# Altium schematic sheet MCU.SchDoc
size A4
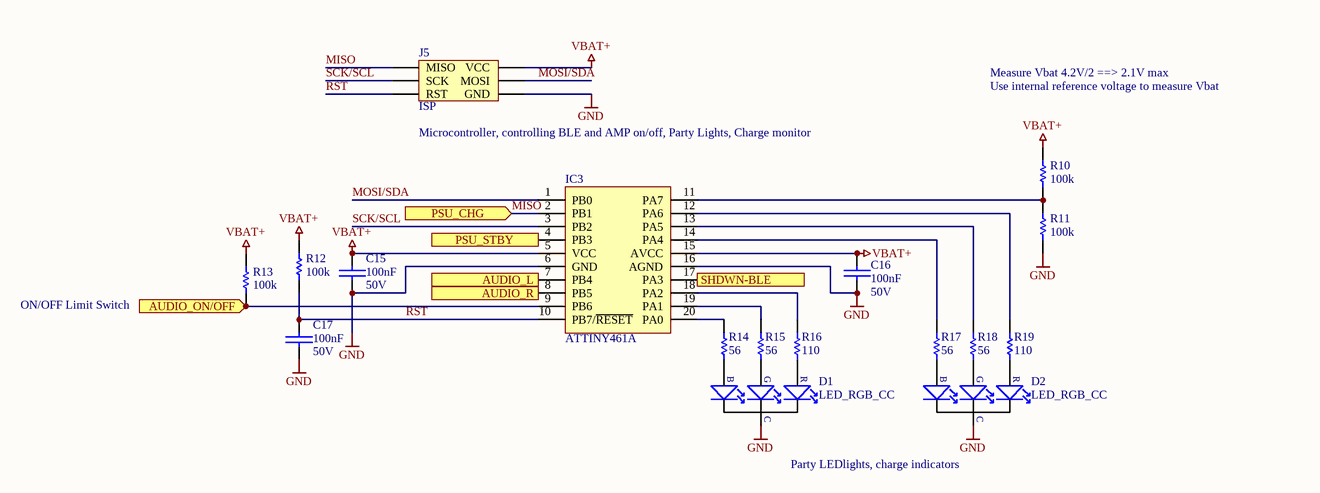
[diagram p0: MCU.SchDoc]

## Parts
C15  value 100nF  voltage: 50V  [TH5.08]  (hidden comment: cap_non_pol)
C16  value 100nF  voltage: 50V  [TH5.08]  (hidden comment: cap_non_pol)
C17  value 100nF  voltage: 50V  [TH5.08]  (hidden comment: cap_non_pol)
D1  LED_RGB_CC  [5MM-RGB-CC]
D2  LED_RGB_CC  [5MM-RGB-CC]
IC3  ATTINY461A  [PDIP-20]
J5  ISP  [ISP_COMPACT]
R10  value 100k  [TH6.3]  (hidden comment: resistor)
R11  value 100k  [TH6.3]  (hidden comment: resistor)
R12  value 100k  [TH6.3]  (hidden comment: resistor)
R13  value 100k  [TH6.3]  (hidden comment: resistor)
R14  value 56  [TH6.3]  (hidden comment: resistor)
R15  value 56  [TH6.3]  (hidden comment: resistor)
R16  value 110  [TH6.3]  (hidden comment: resistor)
R17  value 56  [TH6.3]  (hidden comment: resistor)
R18  value 56  [TH6.3]  (hidden comment: resistor)
R19  value 110  [TH6.3]  (hidden comment: resistor)

## Ports
AUDIO_L (in), AUDIO_ON/OFF (in), AUDIO_R (in), PSU_CHG (in), PSU_STBY (in), SHDWN-BLE (out)

## Nets
GND: C15.2 C16.2 C17.2 D1.C D2.C IC3.6(GND) IC3.16(AGND) J5.GND R11.1
VBAT+: C15.1 C16.1 IC3.5(VCC) IC3.15(AVCC) J5.VCC R10.2 R12.2 R13.2
AUDIO_L: IC3.7(PB4) ; port AUDIO_L
AUDIO_ON/OFF: IC3.9(PB6) R13.1 ; port AUDIO_ON/OFF
AUDIO_R: IC3.8(PB5) ; port AUDIO_R
MISO: IC3.2(PB1) J5.MISO ; port PSU_CHG
MOSI/SDA: IC3.1(PB0) J5.MOSI
PSU_STBY: IC3.4(PB3) ; port PSU_STBY
RST: C17.1 IC3.10(PB7/~{RESET}) J5.RST R12.1
SCK/SCL: IC3.3(PB2) J5.SCK
SHDWN-BLE: IC3.17(PA3) ; port SHDWN-BLE
NetD1_B: D1.B R14.2
NetD1_G: D1.G R15.2
NetD1_R: D1.R R16.2
NetD2_B: D2.B R17.2
NetD2_G: D2.G R18.2
NetD2_R: D2.R R19.2
NetIC3_11: IC3.11(PA7) R10.1 R11.2
NetIC3_12: IC3.12(PA6) R19.1
NetIC3_13: IC3.13(PA5) R18.1
NetIC3_14: IC3.14(PA4) R17.1
NetIC3_18: IC3.18(PA2) R16.1
NetIC3_19: IC3.19(PA1) R15.1
NetIC3_20: IC3.20(PA0) R14.1

## Notes on the sheet
- (near J5) Microcontroller, controlling BLE and AMP on/off, Party Lights, Charge monitor
- Measure Vbat 4.2V/2 ==> 2.1V max
- Use internal reference voltage to measure Vbat
- ON/OFF Limit Switch
- Party LEDlights, charge indicators

## Library data of the parts
C15-C17 = 37: CAP CER TH 100nF X7R 50V; manufacturer_ref: C2761753; manufacturer: FH; id: 37; tolerance: 10%; dielectric: X7R; package: TH5.08; supplier_1: lcsc; supplier_1_partnumber: C385200; price: 0,0237; status: active
D1 D2 = 5: LED (RGB); manufacturer_ref: TJ-L5FCMXHTCSLCRGB-A5; manufacturer: TOGIALED; id: 5; type: LED (RGB); package: 5MM; supplier_1: lcsc; supplier_1_partnumber: C2837020; price: 0,1194; status: active
IC3 = 56: IC MCU 8BIT 4KB FLASH 20DIP; manufacturer_ref: ATTINY461A-PU; manufacturer: Microchip Technology; id: 56; type: Microcontroller; package: 20-PDIP; supplier_1: digikey; supplier_1_partnumber: ATTINY461A-PU-ND, 2057-ICS-320-T-ND; price: 1,91; status: active
J5 = 35: CONN 6 PIN SOLDER PADS FOR ISP; manufacturer_ref: ISP COMPACT; id: 35; nbr_positions_total: 6; package: Pin-6DR; price: 0; status: active
R10-R13 = 56: RES TH 100k OHM 5% 1/4W; manufacturer_ref: CR1/4W-100K±5%-RT52; manufacturer: VO; id: 56; tolerance: 5%; power: 1/4W; package: TH6.3; supplier_1: lcsc; supplier_1_partnumber: C2894520; price: 0,0038; status: active
R14 R15 R17 R18 = 61: RES TH 56 OHM 5% 1/8W; manufacturer_ref: CR1/4W-56Ω±5%-OT52; manufacturer: VO; id: 61; tolerance: 5%; power: 1/8W; package: TH6.3; supplier_1: lcsc; supplier_1_partnumber: C2896859; price: 0,0039; status: active
R16 R19 = 60: RES TH 110 OHM 1% 1/8W; manufacturer_ref: MF1/8W-110Ω±1%T52; manufacturer: Huaxing Mechanical-Elec.; id: 60; tolerance: 1%; power: 1/8W; package: TH6.3; supplier_1: lcsc; supplier_1_partnumber: C713899; price: 0,0053; status: active